# EAGLE schematic main (EAGLE 8.4.0)

## Sheet 1 of 2
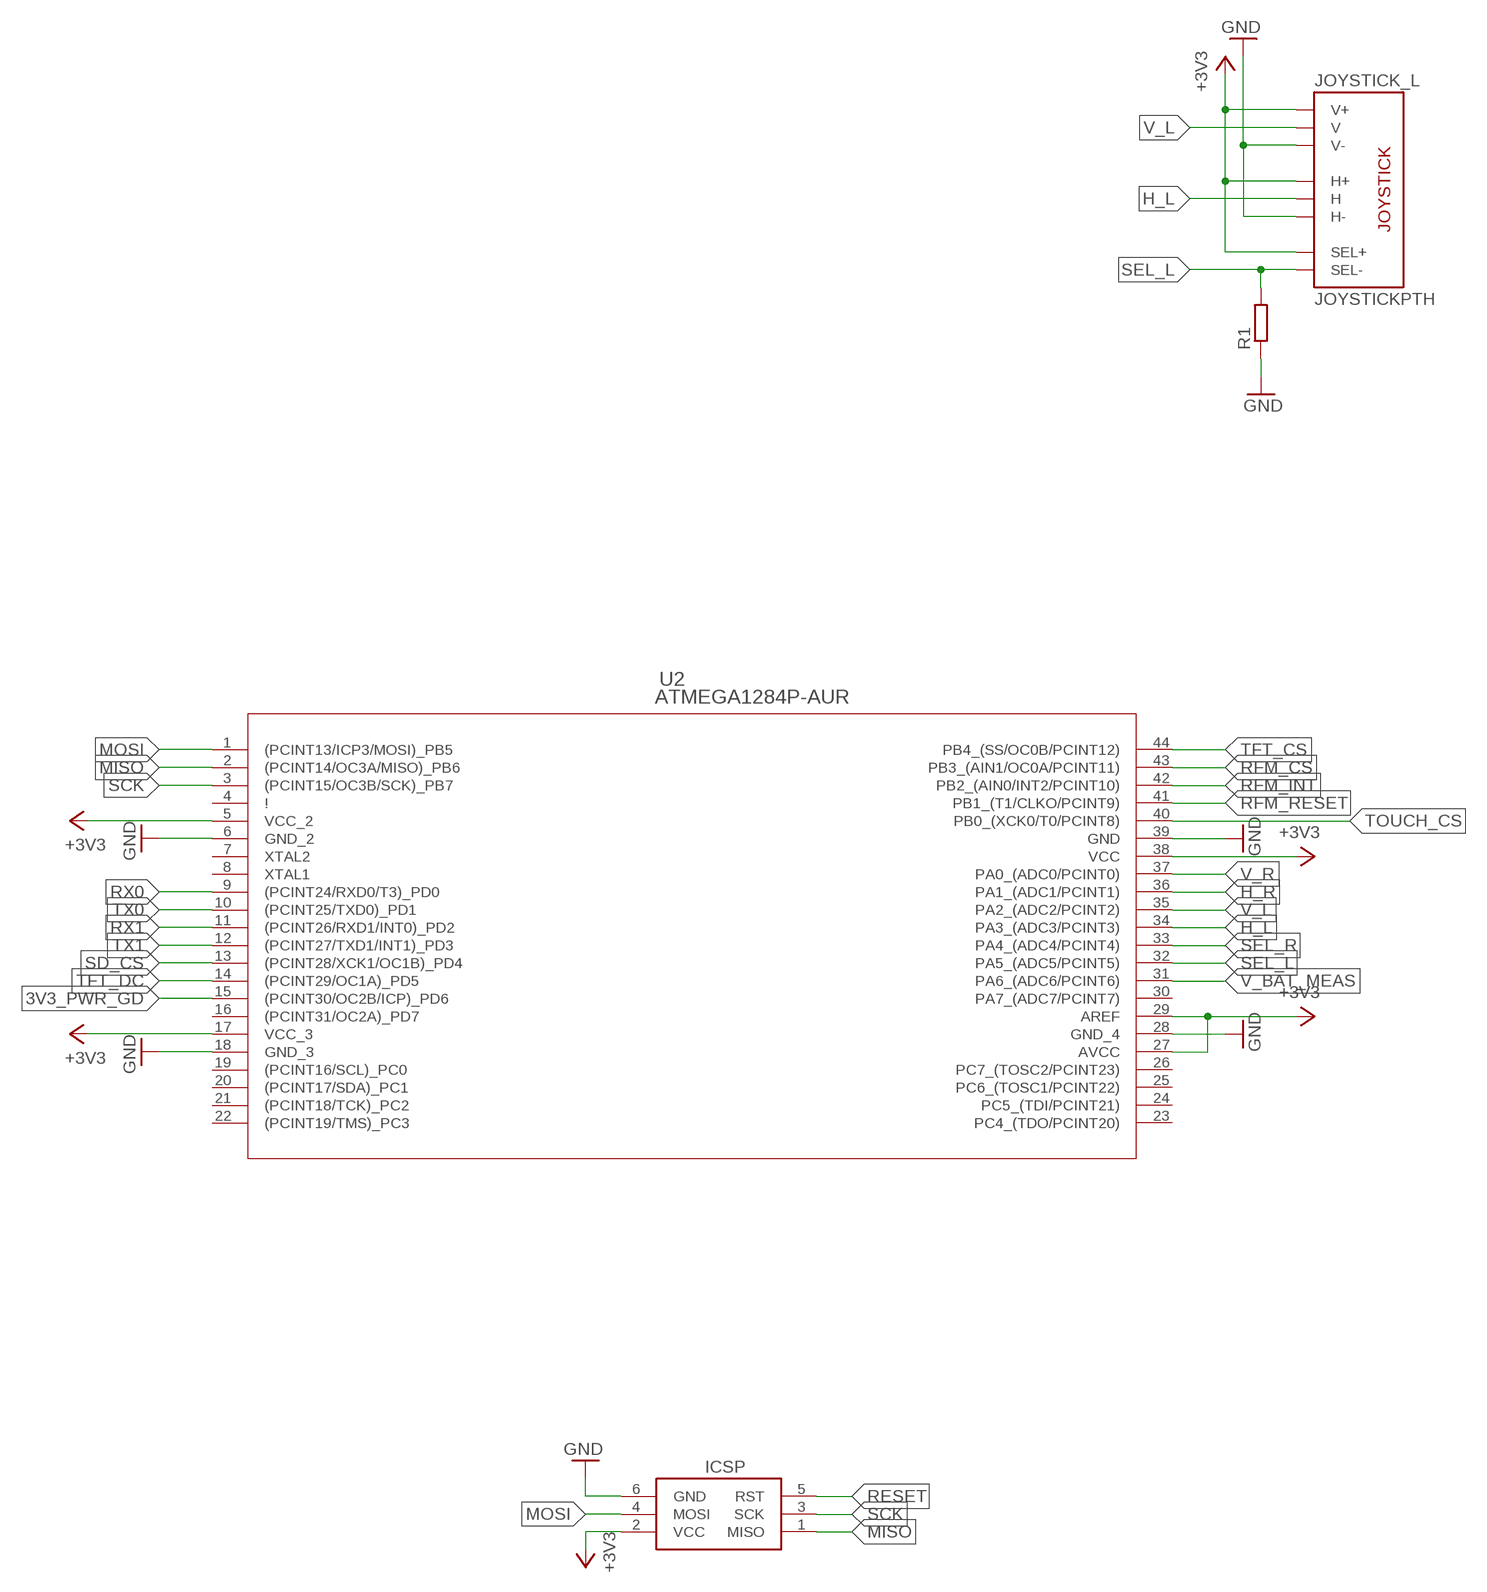
[diagram p0: schematic, sheet 1, part 1 of 2]
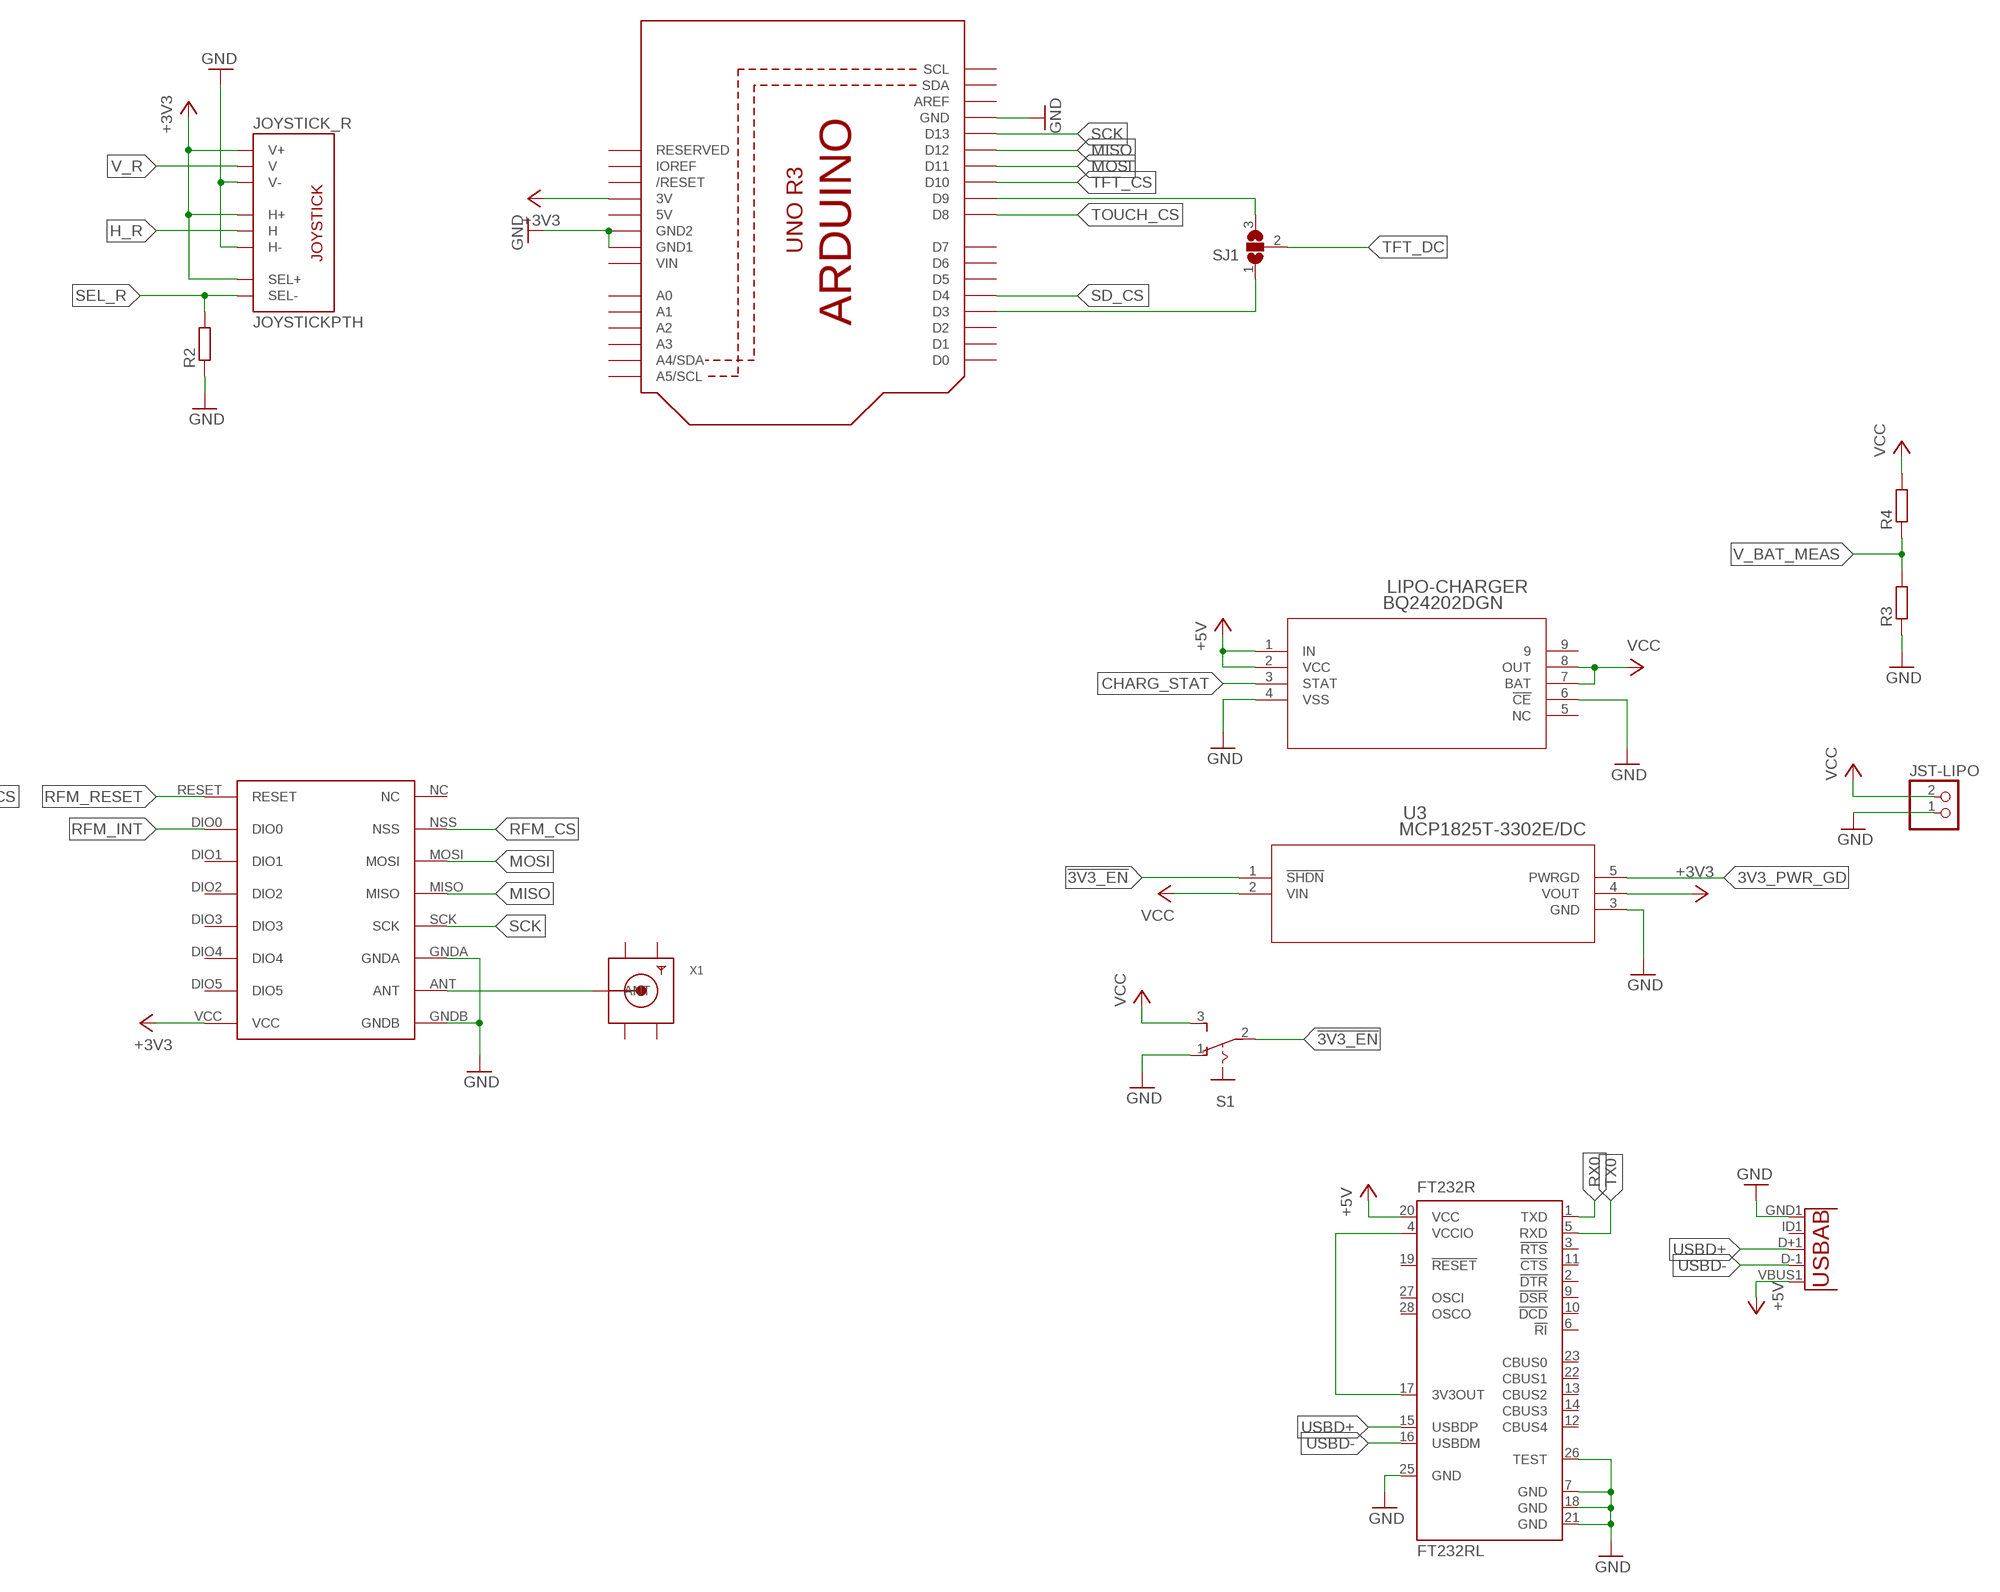
[diagram p1: schematic, sheet 1, part 2 of 2]

### Parts
FT232R  FT232RL  [SSOP28]
ICSP  AVRISP-BOX  [AVRISP-BOX]
JOYSTICK_L  JOYSTICKPTH  [JOYSTICK]
JOYSTICK_R  JOYSTICKPTH  [JOYSTICK]
JST-LIPO  JST_2PIN-SMT-RA  [JST-PH-2-SMT-RA]
LCD  ARDUINOR3-DIMENSION  [ARDUINOR3]
LIPO-CHARGER  BQ24202DGN  [DGN8]
R1  R-EU_R1206  [R1206]
R2  R-EU_R1206  [R1206]
R3  R-EU_R1206  [R1206]
R4  R-EU_R1206  [R1206]
RFM96W  RFM69HW  [RFM]
S1  255SB  [255SB]
SJ1  SJ2W  [SJ_2]
U1  USB""  [USB-MICRO-SMD]
U2  ATMEGA1284P-AUR  [44A]
U3  MCP1825T-3302E/DC  [SOT-223_5MC]
X1  SMACONNECTOR_EDGE  [SMA_EDGELAUNCH]

### Nets
3V3_PWR_GD: U2.15((PCINT30/OC2B/ICP)_PD6) U3.5(PWRGD)
!3V3_EN: S1.2(P) U3.1(!SHDN)
+3V3: ICSP.2(VCC) JOYSTICK_L.B1A(SEL+) JOYSTICK_L.H1(H+) JOYSTICK_L.V1(V+) JOYSTICK_R.B1A(SEL+) JOYSTICK_R.H1(H+) JOYSTICK_R.V1(V+) LCD.3V RFM96W.VCC U2.5(VCC_2) U2.17(VCC_3) U2.27(AVCC) U2.29(AREF) U2.38(VCC) U3.4(VOUT)
+5V: FT232R.20(VCC) LIPO-CHARGER.1(IN) LIPO-CHARGER.2(VCC) U1.VBUS1(VBUS)
CHARG_STAT: LIPO-CHARGER.3(STAT)
GND: FT232R.7(GND) FT232R.18(GND) FT232R.21(GND) FT232R.25(GND) FT232R.26(TEST) ICSP.6(GND) JOYSTICK_L.H3(H-) JOYSTICK_L.V3(V-) JOYSTICK_R.H3(H-) JOYSTICK_R.V3(V-) JST-LIPO.1 LCD.GND LCD.GND1 LCD.GND2 LIPO-CHARGER.4(VSS) LIPO-CHARGER.6(!CE) R1.1 R2.1 R3.1 RFM96W.GNDA RFM96W.GNDB S1.1(O) U1.GND1(GND) U2.6(GND_2) U2.18(GND_3) U2.28(GND_4) U2.39(GND) U3.3(GND)
H_L: JOYSTICK_L.H2(H) U2.34(PA3_(ADC3/PCINT3))
H_R: JOYSTICK_R.H2(H) U2.36(PA1_(ADC1/PCINT1))
MISO: ICSP.1(MISO) LCD.D12 RFM96W.MISO U2.2((PCINT14/OC3A/MISO)_PB6)
MOSI: ICSP.4(MOSI) LCD.D11 RFM96W.MOSI U2.1((PCINT13/ICP3/MOSI)_PB5)
N$1: RFM96W.ANT X1.P(ANT)
N$2: FT232R.4(VCCIO) FT232R.17(3V3OUT)
N$3: LCD.D9 SJ1.3
RESET: ICSP.5(RST)
RFM_CS: RFM96W.NSS U2.43(PB3_(AIN1/OC0A/PCINT11))
RFM_INT: RFM96W.DIO0 U2.42(PB2_(AIN0/INT2/PCINT10))
RFM_RESET: RFM96W.RESET U2.41(PB1_(T1/CLKO/PCINT9))
RX0: FT232R.1(TXD) U2.9((PCINT24/RXD0/T3)_PD0)
RX1: U2.11((PCINT26/RXD1/INT0)_PD2)
SCK: ICSP.3(SCK) LCD.D13 RFM96W.SCK U2.3((PCINT15/OC3B/SCK)_PB7)
SD_CS: LCD.D4 U2.13((PCINT28/XCK1/OC1B)_PD4)
SEL_L: JOYSTICK_L.B2A(SEL-) R1.2 U2.32(PA5_(ADC5/PCINT5))
SEL_R: JOYSTICK_R.B2A(SEL-) R2.2 U2.33(PA4_(ADC4/PCINT4))
TFT_CS: LCD.D10 U2.44(PB4_(SS/OC0B/PCINT12))
TFT_DC: SJ1.2 U2.14((PCINT29/OC1A)_PD5)
TFT_DC_MODIFIED: LCD.D3 SJ1.1
TOUCH_CS: LCD.D8 U2.40(PB0_(XCK0/T0/PCINT8))
TX0: FT232R.5(RXD) U2.10((PCINT25/TXD0)_PD1)
TX1: U2.12((PCINT27/TXD1/INT1)_PD3)
USBD+: FT232R.15(USBDP) U1.D+1(D+)
USBD-: FT232R.16(USBDM) U1.D-1(D-)
V_BAT_MEAS: R3.2 R4.1 U2.31(PA6_(ADC6/PCINT6))
V_L: JOYSTICK_L.V2(V) U2.35(PA2_(ADC2/PCINT2))
V_R: JOYSTICK_R.V2(V) U2.37(PA0_(ADC0/PCINT0))
VCC: JST-LIPO.2 LIPO-CHARGER.7(BAT) LIPO-CHARGER.8(OUT) R4.2 S1.3(S) U3.2(VIN)
Unconnected: FT232R.2(!DTR) FT232R.3(!RTS) FT232R.6(!RI) FT232R.9(!DSR) FT232R.10(!DCD) FT232R.11(!CTS) FT232R.12(CBUS4) FT232R.13(CBUS2) FT232R.14(CBUS3) FT232R.19(!RESET) FT232R.22(CBUS1) FT232R.23(CBUS0) FT232R.27(OSCI) FT232R.28(OSCO) LCD.A0 LCD.A1 LCD.A2 LCD.A3 LCD.A4(A4/SDA) LCD.A5(A5/SCL) LCD.AREF LCD.D0 LCD.D1 LCD.D2 LCD.D5 LCD.D6 LCD.D7 LCD.IOREF LCD.RESERVED LCD.RESET(/RESET) LCD.SCL LCD.SDA LIPO-CHARGER.5(NC) LIPO-CHARGER.9 RFM96W.DIO1 RFM96W.DIO2 RFM96W.DIO3 RFM96W.DIO4 RFM96W.DIO5 RFM96W.NC U1.ID1(USBID) U2.4(!) U2.7(XTAL2) U2.8(XTAL1) U2.16((PCINT31/OC2A)_PD7) U2.19((PCINT16/SCL)_PC0) U2.20((PCINT17/SDA)_PC1) U2.21((PCINT18/TCK)_PC2) U2.22((PCINT19/TMS)_PC3) U2.23(PC4_(TDO/PCINT20)) U2.24(PC5_(TDI/PCINT21)) U2.25(PC6_(TOSC1/PCINT22)) U2.26(PC7_(TOSC2/PCINT23)) U2.30(PA7_(ADC7/PCINT7))

## Sheet 2 of 2

## Power pins joined to a net without a drawn wire
5V: LCD.5V
GND1: X1.GND@4(GND1)
GND2: X1.GND@3(GND2)
GND3: X1.GND@2(GND3)
GND4: X1.GND@1(GND4)
VIN: LCD.VIN

## Library data of the parts
FT232R = ftdichip:FT232R: Source: http://www.ftdichip.com/Documents/DataSheets/DS_FT232R_v104.pdf; MPN: FT232RL; OC_FARNELL: 1146032; OC_NEWARK: 91K9918
ICSP = adafruit:AVRISP: AVR ISP HEADER Standard 6 pin header for AVR programming
JOYSTICK_L JOYSTICK_R = adafruit:JOYSTICK: Thumb Joystick Joystick commonly found in PS2 controllers. Two pots and a select switch. Adapted from Sparkfun Library (but for more common 6mm switch sticks)
JST-LIPO = adafruit:JST_2PIN: JST 2-Pin Connectors of various flavors SMT-RA (S2B-PH-SM4) 4UConnector #17311 SMT (B2B-PH-SM4) THM-RA (S2B-PH) THM (B2B-PH)
LCD = adafruit:ARDUINOR3: This is a new object for the new Arduino R3 - with extra pins that you may want to use (such as IOref, and duplicated A4/A5
LIPO-CHARGER = BQ24202DGN:BQ24202DGN; MANUFACTURER_PART_NUMBER: BQ24202DGN; VENDOR: Texas Instruments
R1-R4 = rcl:R-EU_: RESISTOR, European symbol
RFM96W = hoperf:RFM69HW
S1 = switch:255SB: SLIDING SWITCH Distributor Buerklin, 11G810
SJ1 = jumper:SJ2W: SMD solder JUMPER
U1 = MicroUSB:USB: This is a USB AB connector that is compatible with USB OTG. i.e. this connector can serve as a host or device
U2 = m1284p:ATMEGA1284P-AUR; MANUFACTURER_PART_NUMBER: ATMEGA1284PAUR; VENDOR: Atmel
U3 = MCP1825T:MCP1825T-3302E/DC; MANUFACTURER_PART_NUMBER: MCP1825T3302EDC; VENDOR: Microchip
X1 = adafruit:SMACONNECTOR: SMA Connector 90° DIP SMA Connector, 50 Ohm (4UConnector: 07259)